# EAGLE design SSB Transceiver_LC Lowpass Filter (EAGLE 9.4.2)
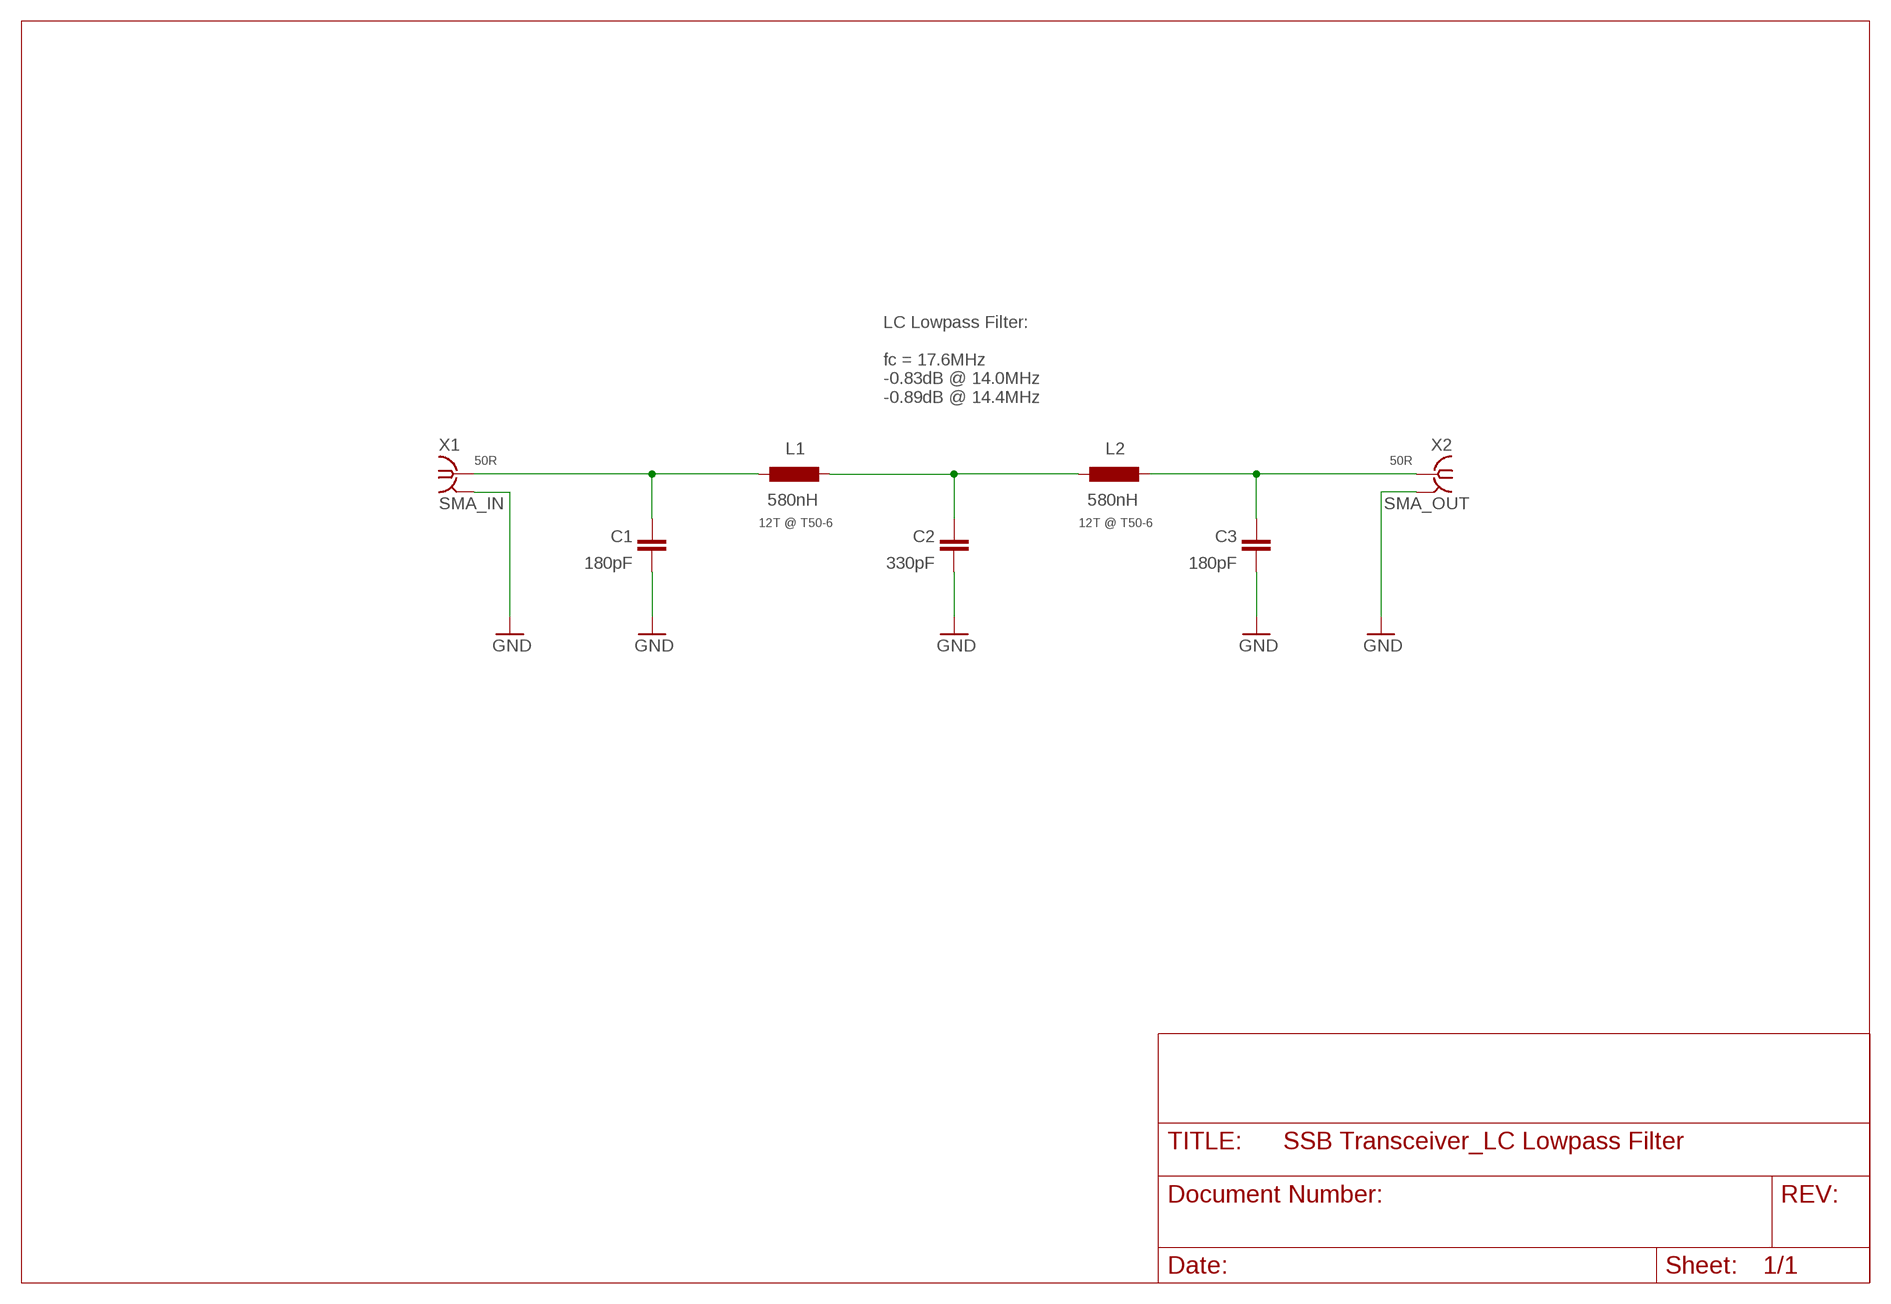
[diagram p0: schematic, sheet 1]

## Parts
C1  180pF  C-EUC0805  [C0805]
C2  330pF  C-EUC0805  [C0805]
C3  180pF  C-EUC0805  [C0805]
L1  580nH  T50-6  [T50-6SMD]
L2  580nH  T50-6  [T50-6SMD]
X1  SMA_IN  SMA-142-0711-821/826  [J502-ND-142-0711-821/826]
X2  SMA_OUT  SMA-142-0711-821/826  [J502-ND-142-0711-821/826]

## Nets
GND: C1.1 C2.1 C3.1 X1.G@1 X1.G@2 X1.G@3 X1.G@4 X2.G@1 X2.G@2 X2.G@3 X2.G@4
N$1: C2.2 L1.P$2 L2.P$1
N$3: C3.2 L2.P$2 X2.1
N$4: C1.2 L1.P$1 X1.1

## Notes on the sheet
- LC Lowpass Filter:
  
  fc = 17.6MHz
  -0.83dB @ 14.0MHz
  -0.89dB @ 14.4MHz
- 50R | 50R
- 12T @ T50-6 | 12T @ T50-6

## Library data of the parts
C1-C3 = rcl:C-EU: CAPACITOR, European symbol; SPICEPREFIX: C
L1 L2 = Ham Radio:T50-6
X1 X2 = con-coax:SMA-: SMA 50 Ohm End Launch Jack Receptacle - Round Contact Johnson Components Source: www.johnsoncomponents.com .. J502-ND.pdf; MF: JOHNSON COMPONENTS; MPN: 142-0711-821; OC_FARNELL: 1019328; OC_NEWARK: 16F3627

## Board
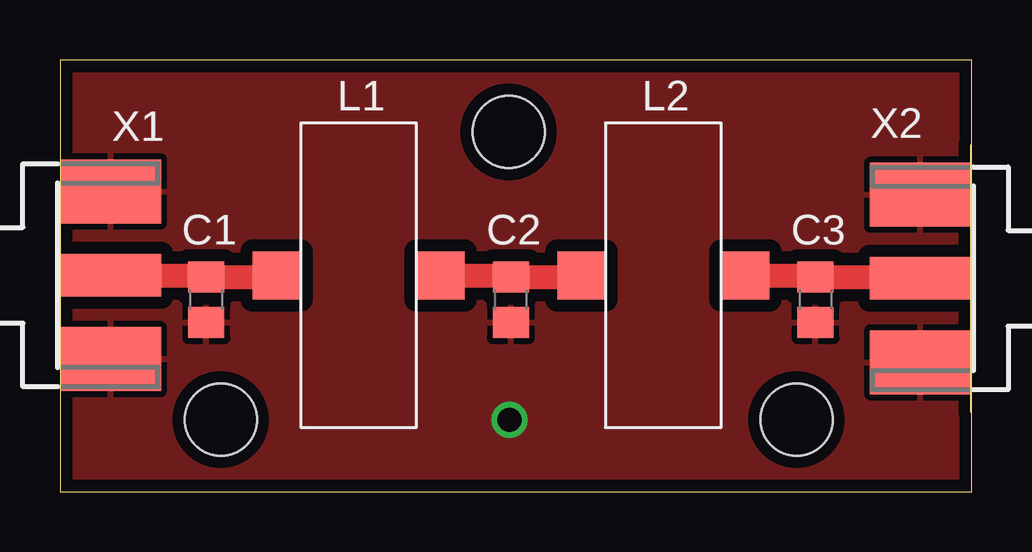
[diagram p1: board, top side]
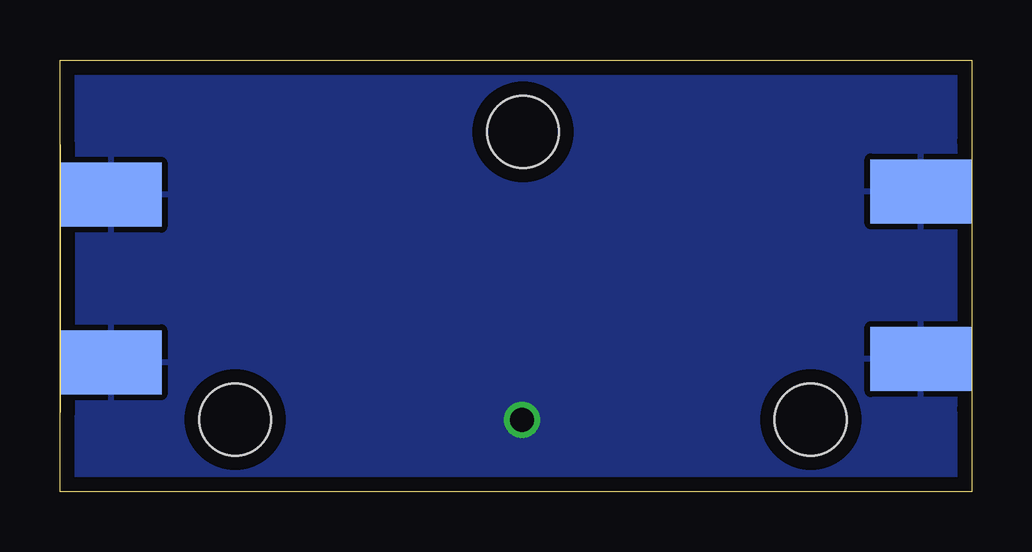
[diagram p2: board, bottom side, seen from below]

Size 38 x 18 mm. Coordinates in mm from the lower left corner, seen from the top.
Outline: 0,0 38,0 38,18 0,18 0,0
Copper layers (1*16): Top 0.035mm / dielectric 1.5mm / Bottom 0.035mm
Design rules "default *": minimum track width 6mil, minimum drill 0.35mm, track to track 20mil, track to pad 20mil, pad to pad 20mil, via to via 20mil, smd to smd 6mil, copper to edge 20mil, drill to drill 6mil, minimum pad ring 10mil, minimum via ring 8mil, stop-mask expansion 4mil, vias tented up to drill 0mil, thermal gap 10mil
Holes 3 mm at 6.7,3 18.7,15 30.7,3

### Footprints (pad centres in the part's own frame; a part is rotated, then mirrored left to right if it is on the bottom)
C0805 = smd 1.3 x 1.5: 1 -0.95,0; 2 0.95,0
T50-6SMD = smd 2 x 2: P$1 -3.54,0; P$2 3.29,0
J502-ND-142-0711-821/826 = smd 4.191 x 1.778: 1 2.115,0 | smd 4.191 x 2.667: G@1 2.115,3.495; G@2 2.115,-3.495 | smd 4.191 x 2.667 bottom: G@3 2.115,3.495; G@4 2.115,-3.495

### Placement (x,y rotation side)
C1  6.1,8 90 top
C2  18.8,8 90 top
C3  31.5,8 90 top
L1  12.57,9.02 0 top
L2  25.27,9.02 0 top
X1  0,9.02 0 top
X2  37.97,8.89 180 top

### Tracks (layer width: path | path; a pad name or v marks a point on that pad's centre or on a via)
GND  (via drill 1)
  other vias: 18.73,3
  pour Top (isolate 0.5): 0,0 0,18 38,18 38,0
  pour Bottom (isolate 0.6): 0,0 0,18 38,18 38,0
N$1
  Top 1: L1.P$2 18.73,9.02 C2.2 21.67,8.95 L2.P$1
N$3
  Top 1: L2.P$2 31.43,9.02 C3.2 35.8,8.95 X2.1
N$4
  Top 1: X1.1 6.03,9.02 C1.2 8.97,8.95 L1.P$1